# Altium schematic sheet Phaser_1.SchDoc
size A; DocumentNumber: 3; SheetNumber: 3; SheetTotal: 5
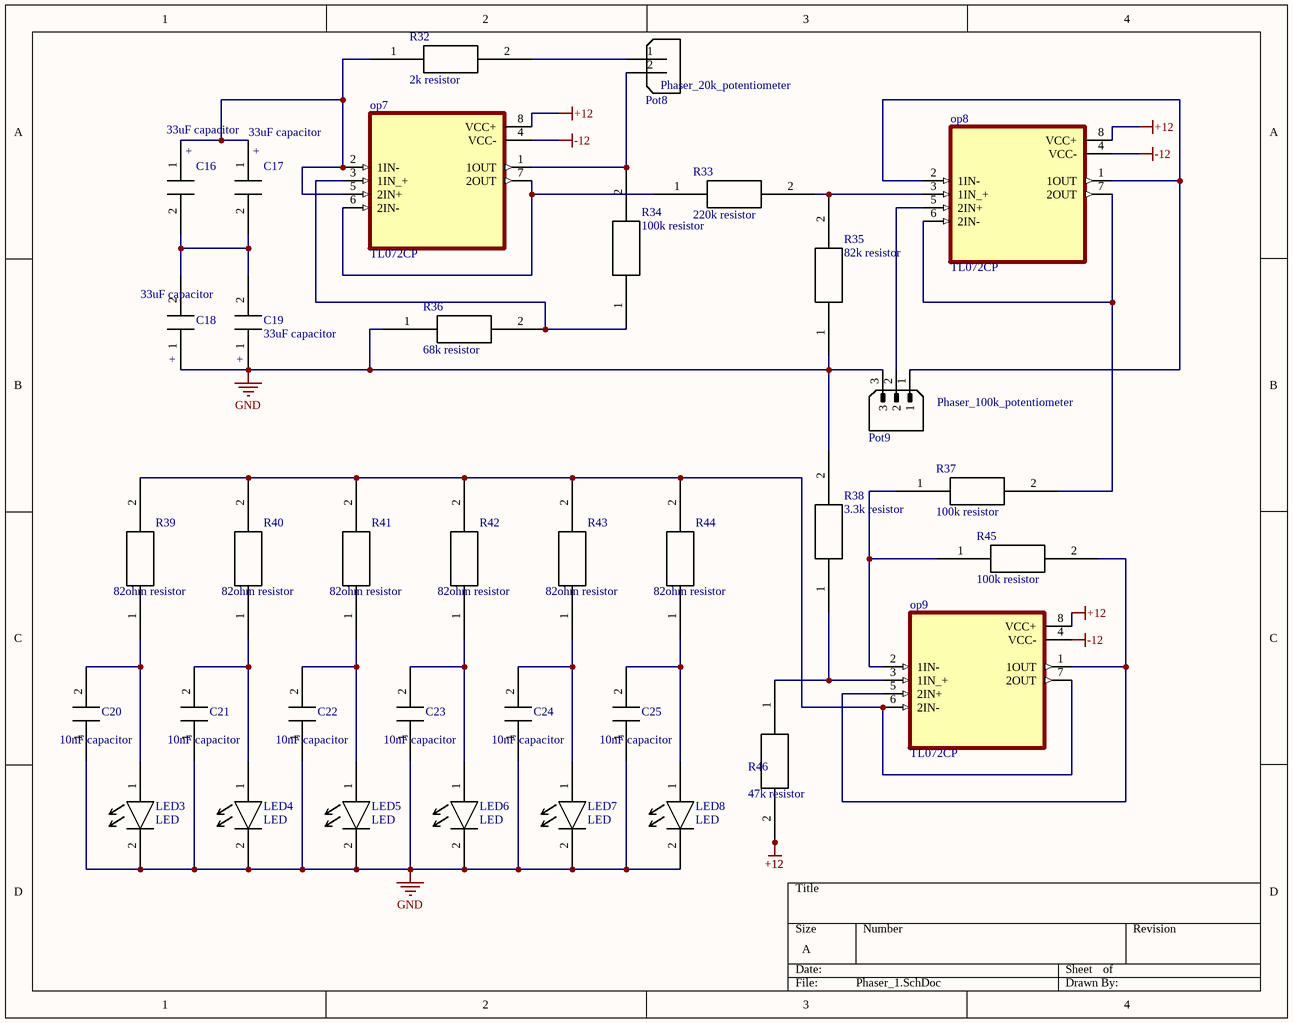
[diagram p0: Phaser_1.SchDoc]

## Parts
C16  33uF capacitor  [33uF]
C17  33uF capacitor  [33uF]
C18  33uF capacitor  [33uF]
C19  33uF capacitor  [33uF]
C20  10nF capacitor  [10nF]
C21  10nF capacitor  [10nF]
C22  10nF capacitor  [10nF]
C23  10nF capacitor  [10nF]
C24  10nF capacitor  [10nF]
C25  10nF capacitor  [10nF]
LED3  LED  [LED]
LED4  LED  [LED]
LED5  LED  [LED]
LED6  LED  [LED]
LED7  LED  [LED]
LED8  LED  [LED]
op7  TL072CP  [TL072CP]
op8  TL072CP  [TL072CP]
op9  TL072CP  [TL072CP]
Pot8  Phaser_20k_potentiometer  [2pin_JST_non_polarized]
Pot9  Phaser_100k_potentiometer  [3pin_jst]
R32  2k resistor  [2k]
R33  220k resistor  [220k]
R34  100k resistor  [100k]
R35  82k resistor  [82k]
R36  68k resistor  [68k]
R37  100k resistor  [100k]
R38  3.3k resistor  [3.3k]
R39  82ohm resistor  [82]
R40  82ohm resistor  [82]
R41  82ohm resistor  [82]
R42  82ohm resistor  [82]
R43  82ohm resistor  [82]
R44  82ohm resistor  [82]
R45  100k resistor  [100k]
R46  47k resistor  [47k]

## Nets
+12: op7.8(VCC+) op8.8(VCC+) op9.8(VCC+) R46.2
-12: op7.4(VCC-) op8.4(VCC-) op9.4(VCC-)
GND: C18.1 C19.1 C20.1 C21.1 C22.1 C23.1 C24.1 C25.1 LED3.2 LED4.2 LED5.2 LED6.2 LED7.2 LED8.2 Pot9.3 R35.1 R36.1 R38.2
NetC16_1: C16.1 C17.1 op7.2(1IN-) op7.5(2IN+) R32.1
NetC16_2: C16.2 C17.2 C18.2 C19.2
NetC20_2: C20.2 LED3.1 R39.1
NetC21_2: C21.2 LED4.1 R40.1
NetC22_2: C22.2 LED5.1 R41.1
NetC23_2: C23.2 LED6.1 R42.1
NetC24_2: C24.2 LED7.1 R43.1
NetC25_2: C25.2 LED8.1 R44.1
Netop7_1: op7.1(1OUT) Pot8.2 R34.2
Netop7_3: op7.3(1IN_+) R34.1 R36.2
Netop7_6: op7.6(2IN-) op7.7(2OUT) R33.1
Netop8_1: op8.1(1OUT) op8.2(1IN-) Pot9.1
Netop8_3: op8.3(1IN_+) R33.2 R35.2
Netop8_5: op8.5(2IN+) Pot9.2
Netop8_6: op8.6(2IN-) op8.7(2OUT) R37.2
Netop9_1: op9.1(1OUT) op9.5(2IN+) R45.2
Netop9_2: op9.2(1IN-) R37.1 R45.1
Netop9_3: op9.3(1IN_+) R38.1 R46.1
Netop9_6: op9.6(2IN-) op9.7(2OUT) R39.2 R40.2 R41.2 R42.2 R43.2 R44.2
NetPot8_1: Pot8.1 R32.2

## Notes on the sheet
- (in symbol 33uF capacitor) +

## Library data of the parts
Pot8 = 2pin_jst_non_polarized
Pot9 = 3pin_jst